# Altium schematic sheet SDRAM.SchDoc: SDRAM (MICRON)
size A4; Date: 25-FEB-2015; Author: A.B; CompanyName: STMicroelectronics; Address1: 12, Rue Jules HOROWITZ; Address2: 38019 Grenoble; Address3: FRANCE; DocumentNumber: MB1191; Revision: B-02; SheetNumber: 7; SheetTotal: 13; Project: STM32F746G-DISCO
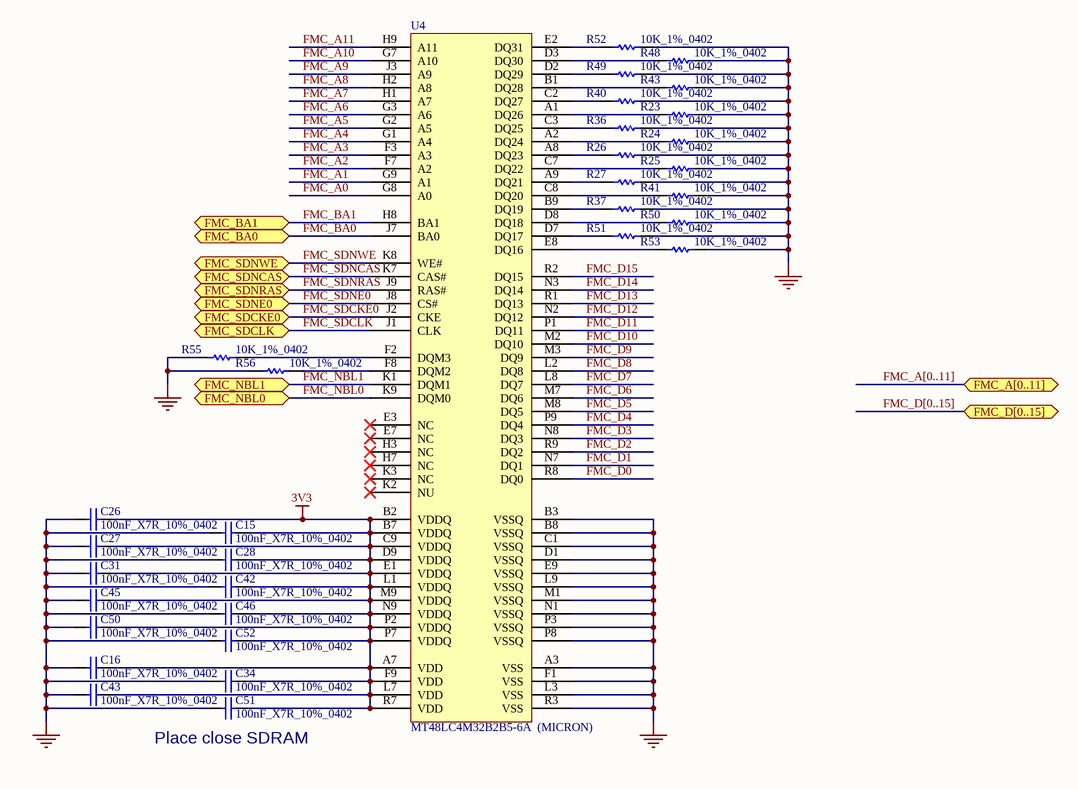
[diagram p0: SDRAM.SchDoc]

## Parts
C15  100nF_X7R_10%_0402  [0402C]
C16  100nF_X7R_10%_0402  [0402C]
C26  100nF_X7R_10%_0402  [0402C]
C27  100nF_X7R_10%_0402  [0402C]
C28  100nF_X7R_10%_0402  [0402C]
C31  100nF_X7R_10%_0402  [0402C]
C34  100nF_X7R_10%_0402  [0402C]
C42  100nF_X7R_10%_0402  [0402C]
C43  100nF_X7R_10%_0402  [0402C]
C45  100nF_X7R_10%_0402  [0402C]
C46  100nF_X7R_10%_0402  [0402C]
C50  100nF_X7R_10%_0402  [0402C]
C51  100nF_X7R_10%_0402  [0402C]
C52  100nF_X7R_10%_0402  [0402C]
R23  10K_1%_0402  [0402R]
R24  10K_1%_0402  [0402R]
R25  10K_1%_0402  [0402R]
R26  10K_1%_0402  [0402R]
R27  10K_1%_0402  [0402R]
R36  10K_1%_0402  [0402R]
R37  10K_1%_0402  [0402R]
R40  10K_1%_0402  [0402R]
R41  10K_1%_0402  [0402R]
R43  10K_1%_0402  [0402R]
R48  10K_1%_0402  [0402R]
R49  10K_1%_0402  [0402R]
R50  10K_1%_0402  [0402R]
R51  10K_1%_0402  [0402R]
R52  10K_1%_0402  [0402R]
R53  10K_1%_0402  [0402R]
R55  10K_1%_0402  [0402R]
R56  10K_1%_0402  [0402R]
U4  MT48LC4M32B2B5-6A  (MICRON)  [FBGA90_0R8_8X13]

## Ports
FMC_A[0..11], FMC_BA0, FMC_BA1, FMC_D[0..15], FMC_NBL0, FMC_NBL1, FMC_SDCKE0, FMC_SDCLK, FMC_SDNCAS, FMC_SDNE0, FMC_SDNRAS, FMC_SDNWE

## Nets
3V3: C15.2 C16.2 C26.2 C27.2 C28.2 C31.2 C34.2 C42.2 C43.2 C45.2 C46.2 C50.2 C51.2 C52.2 U4.A7(VDD) U4.B2(VDDQ) U4.B7(VDDQ) U4.C9(VDDQ) U4.D9(VDDQ) U4.E1(VDDQ) U4.F9(VDD) U4.L1(VDDQ) U4.L7(VDD) U4.M9(VDDQ) U4.N9(VDDQ) U4.P2(VDDQ) U4.P7(VDDQ) U4.R7(VDD)
GND: C15.1 C16.1 C26.1 C27.1 C28.1 C31.1 C34.1 C42.1 C43.1 C45.1 C46.1 C50.1 C51.1 C52.1 R23.2 R24.2 R25.2 R26.2 R27.2 R36.2 R37.2 R40.2 R41.2 R43.2 R48.2 R49.2 R50.2 R51.2 R52.2 R53.2 R55.1 R56.1 U4.A3(VSS) U4.B3(VSSQ) U4.B8(VSSQ) U4.C1(VSSQ) U4.D1(VSSQ) U4.E9(VSSQ) U4.F1(VSS) U4.L3(VSS) U4.L9(VSSQ) U4.M1(VSSQ) U4.N1(VSSQ) U4.P3(VSSQ) U4.P8(VSSQ) U4.R3(VSS)
FMC_A0: U4.G8(A0)
FMC_A1: U4.G9(A1)
FMC_A2: U4.F7(A2)
FMC_A3: U4.F3(A3)
FMC_A4: U4.G1(A4)
FMC_A5: U4.G2(A5)
FMC_A6: U4.G3(A6)
FMC_A7: U4.H1(A7)
FMC_A8: U4.H2(A8)
FMC_A9: U4.J3(A9)
FMC_A10: U4.G7(A10)
FMC_A11: U4.H9(A11)
FMC_BA0: U4.J7(BA0) ; port FMC_BA0
FMC_BA1: U4.H8(BA1) ; port FMC_BA1
FMC_D0: U4.R8(DQ0)
FMC_D1: U4.N7(DQ1)
FMC_D2: U4.R9(DQ2)
FMC_D3: U4.N8(DQ3)
FMC_D4: U4.P9(DQ4)
FMC_D5: U4.M8(DQ5)
FMC_D6: U4.M7(DQ6)
FMC_D7: U4.L8(DQ7)
FMC_D8: U4.L2(DQ8)
FMC_D9: U4.M3(DQ9)
FMC_D10: U4.M2(DQ10)
FMC_D11: U4.P1(DQ11)
FMC_D12: U4.N2(DQ12)
FMC_D13: U4.R1(DQ13)
FMC_D14: U4.N3(DQ14)
FMC_D15: U4.R2(DQ15)
FMC_NBL0: U4.K9(DQM0) ; port FMC_NBL0
FMC_NBL1: U4.K1(DQM1) ; port FMC_NBL1
FMC_SDCKE0: U4.J2(CKE) ; port FMC_SDCKE0
FMC_SDCLK: U4.J1(CLK) ; port FMC_SDCLK
FMC_SDNCAS: U4.K7(CAS#) ; port FMC_SDNCAS
FMC_SDNE0: U4.J8(CS#) ; port FMC_SDNE0
FMC_SDNRAS: U4.J9(RAS#) ; port FMC_SDNRAS
FMC_SDNWE: U4.K8(WE#) ; port FMC_SDNWE
NetR23_1: R23.1 U4.A1(DQ26)
NetR24_1: R24.1 U4.A2(DQ24)
NetR25_1: R25.1 U4.C7(DQ22)
NetR26_1: R26.1 U4.A8(DQ23)
NetR27_1: R27.1 U4.A9(DQ21)
NetR36_1: R36.1 U4.C3(DQ25)
NetR37_1: R37.1 U4.B9(DQ19)
NetR40_1: R40.1 U4.C2(DQ27)
NetR41_1: R41.1 U4.C8(DQ20)
NetR43_1: R43.1 U4.B1(DQ28)
NetR48_1: R48.1 U4.D3(DQ30)
NetR49_1: R49.1 U4.D2(DQ29)
NetR50_1: R50.1 U4.D8(DQ18)
NetR51_1: R51.1 U4.D7(DQ17)
NetR52_1: R52.1 U4.E2(DQ31)
NetR53_1: R53.1 U4.E8(DQ16)
NetR55_2: R55.2 U4.F2(DQM3)
NetR56_2: R56.2 U4.F8(DQM2)

Not connected (* = marked no-connect by the designer): U4 E3(NC)* E7(NC)* H3(NC)* H7(NC)* K2(NU)* K3(NC)*

## Buses and harness runs
bus FMC_A[0..11] = port FMC_A[0..11]
bus FMC_D[0..15] = port FMC_D[0..15]

## Notes on the sheet
- (near C51) Place close SDRAM
- Title:
- Project:
- Size:
- Date:
- A4
- Reference:
- Sheet:
- Revision:
- of

## Library data of the parts
C15 C16 C26-C28 C31 C34 C42 C43 C45 C46 C50-C52 = Cap_100nF_X7R_10%_0402: Capacitor,100nF,16V,X7R,10%,0402,YAGEO; Manuf_Part_1: CC0402KRX7R7BB104; Revision: July-2002: Re-released for DXP Platform.; Value: 100nF; Order: CC0402KRX7R7BB104; Manuf_1: YAGEO; ECCN_US/EU: n/a
R23-R27 R36 R37 R40 R41 R43 R48-R53 R55 R56 = Res_10K_1%_0402: Resistor,10K,0402,1%,YAGEO; Manuf_Part_1: RC0402FR-0710KL; Value: 10K; Manuf_1: YAGEO; Order: RC0402FR-0710KL; ECCN_US/EU: n/a
U4 = MT48LC4M32B2B5-6A: SDRAM 128MBIT (4M x 32) 166MHZ 90-VFBGA (8x13); Manuf_Part_1: MT48LC4M32B2B5-6A IT:L TR; Order: MT48LC4M32B2B5-6A IT:L TR-ND; ECCN_US/EU: EAR99/NEC; Provided: ST; Ref St: 9171434; Manuf_1: MICRON; Distrib: MICRON